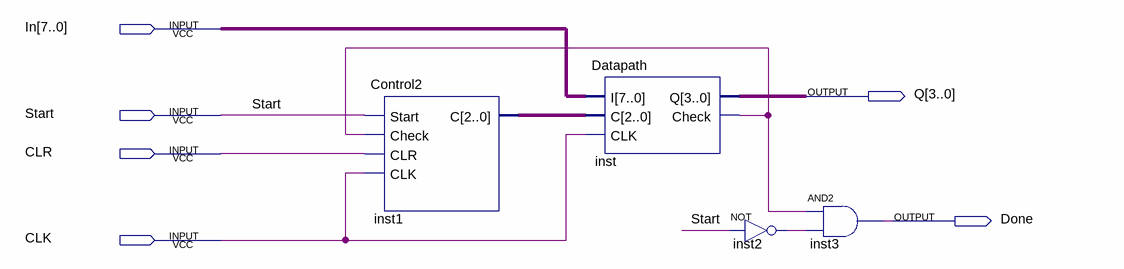
[diagram p0: schematic sheet]
// Quartus schematic counterbit1.bdf as structural Verilog: 4 symbols, 6 pins
module counterbit1 (
  input  [7:0] In,
  input  Start,
  input  CLR,
  input  CLK,
  output [3:0] Q,
  output Done
);

  wire inst2_out, inst_check;
  wire [2:0] inst1_c;

  Control2 inst1 (.Start(Start), .Check(inst_check), .CLR(CLR), .CLK(CLK), .C(inst1_c));
  Datapath inst (.I(In), .C(inst1_c), .CLK(CLK), .Q(Q), .Check(inst_check));
  not inst2 (inst2_out, Start);
  and inst3 (Done, inst_check, inst2_out);
endmodule
